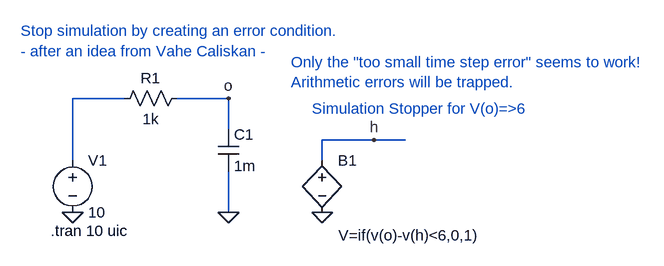
[diagram p0: schematic Simulation_stopper.asc]
Simulation_stopper.asc, the LTspice schematic file:
Version 4
SHEET 1 1060 680
WIRE 192 32 112 32
WIRE 352 32 272 32
WIRE 352 80 352 32
WIRE 576 96 496 96
WIRE 624 96 576 96
WIRE 112 128 112 32
WIRE 496 128 496 96
WIRE 352 208 352 144
FLAG 112 208 0
FLAG 352 32 o
FLAG 352 208 0
FLAG 496 208 0
FLAG 576 96 h
SYMBOL voltage 112 112 R0
WINDOW 123 0 0 Left 0
WINDOW 39 0 0 Left 0
SYMATTR InstName V1
SYMATTR Value 10
SYMBOL res 288 16 R90
WINDOW 0 0 56 VBottom 0
WINDOW 3 32 56 VTop 0
SYMATTR InstName R1
SYMATTR Value 1k
SYMBOL cap 336 80 R0
SYMATTR InstName C1
SYMATTR Value 1m
SYMBOL bv 496 112 R0
WINDOW 3 25 131 Left 0
SYMATTR InstName B1
SYMATTR Value V=if(v(o)-v(h)<6,0,1)
TEXT 78 236 Left 0 !.tran 10 uic
TEXT 480 48 Left 0 ;Simulation Stopper for V(o)=>6
TEXT 32 -72 Left 0 ;Stop simulation by creating an error condition.\n- after an idea from Vahe Caliskan -
TEXT 448 -24 Left 0 ;Only the "too small time step error" seems to work!\nArithmetic errors will be trapped.

The netlist it stands for:
* Simulation_stopper.asc
V1 N001 0 10
R1 o N001 1k
C1 o 0 1m
B1 h 0 V=if(v(o)-v(h)<6,0,1)
.tran 10 uic
* Simulation Stopper for V(o)=>6
* Stop simulation by creating an error condition.
* - after an idea from Vahe Caliskan -
* Only the "too small time step error" seems to work!
* Arithmetic errors will be trapped.
.backanno
.end